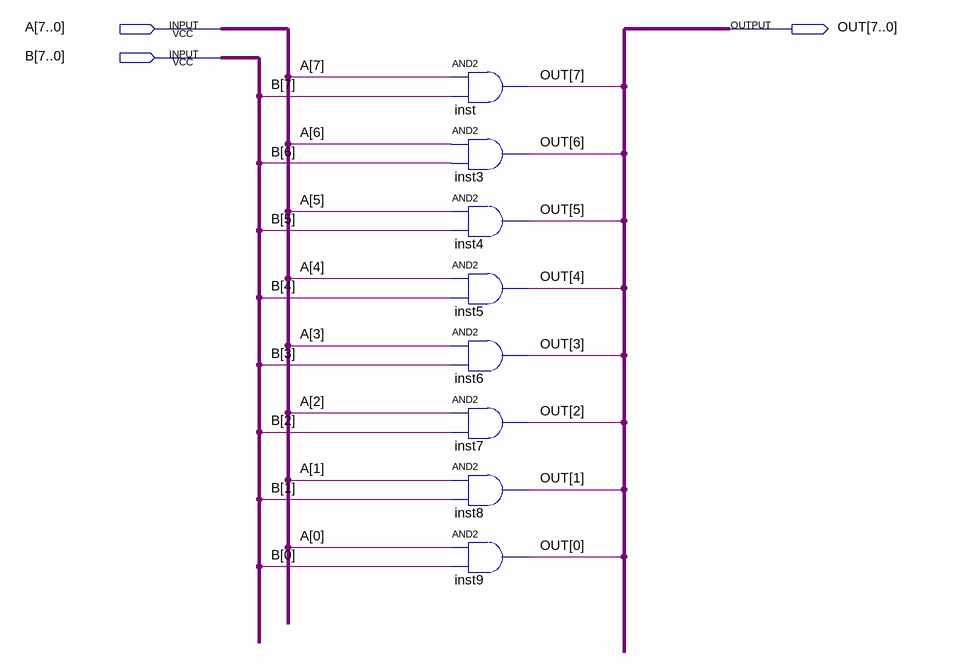
[diagram p0: schematic sheet]
// Quartus schematic AND8BIT.bdf as structural Verilog: 8 symbols, 3 pins
module AND8BIT (
  input  [7:0] A,
  input  [7:0] B,
  output [7:0] OUT
);

  and inst (OUT[7], A[7], B[7]);
  and inst3 (OUT[6], A[6], B[6]);
  and inst4 (OUT[5], A[5], B[5]);
  and inst5 (OUT[4], A[4], B[4]);
  and inst6 (OUT[3], A[3], B[3]);
  and inst7 (OUT[2], A[2], B[2]);
  and inst8 (OUT[1], A[1], B[1]);
  and inst9 (OUT[0], A[0], B[0]);
endmodule
